# EAGLE design OpenSprinkler_v1.1 (EAGLE 5.11)
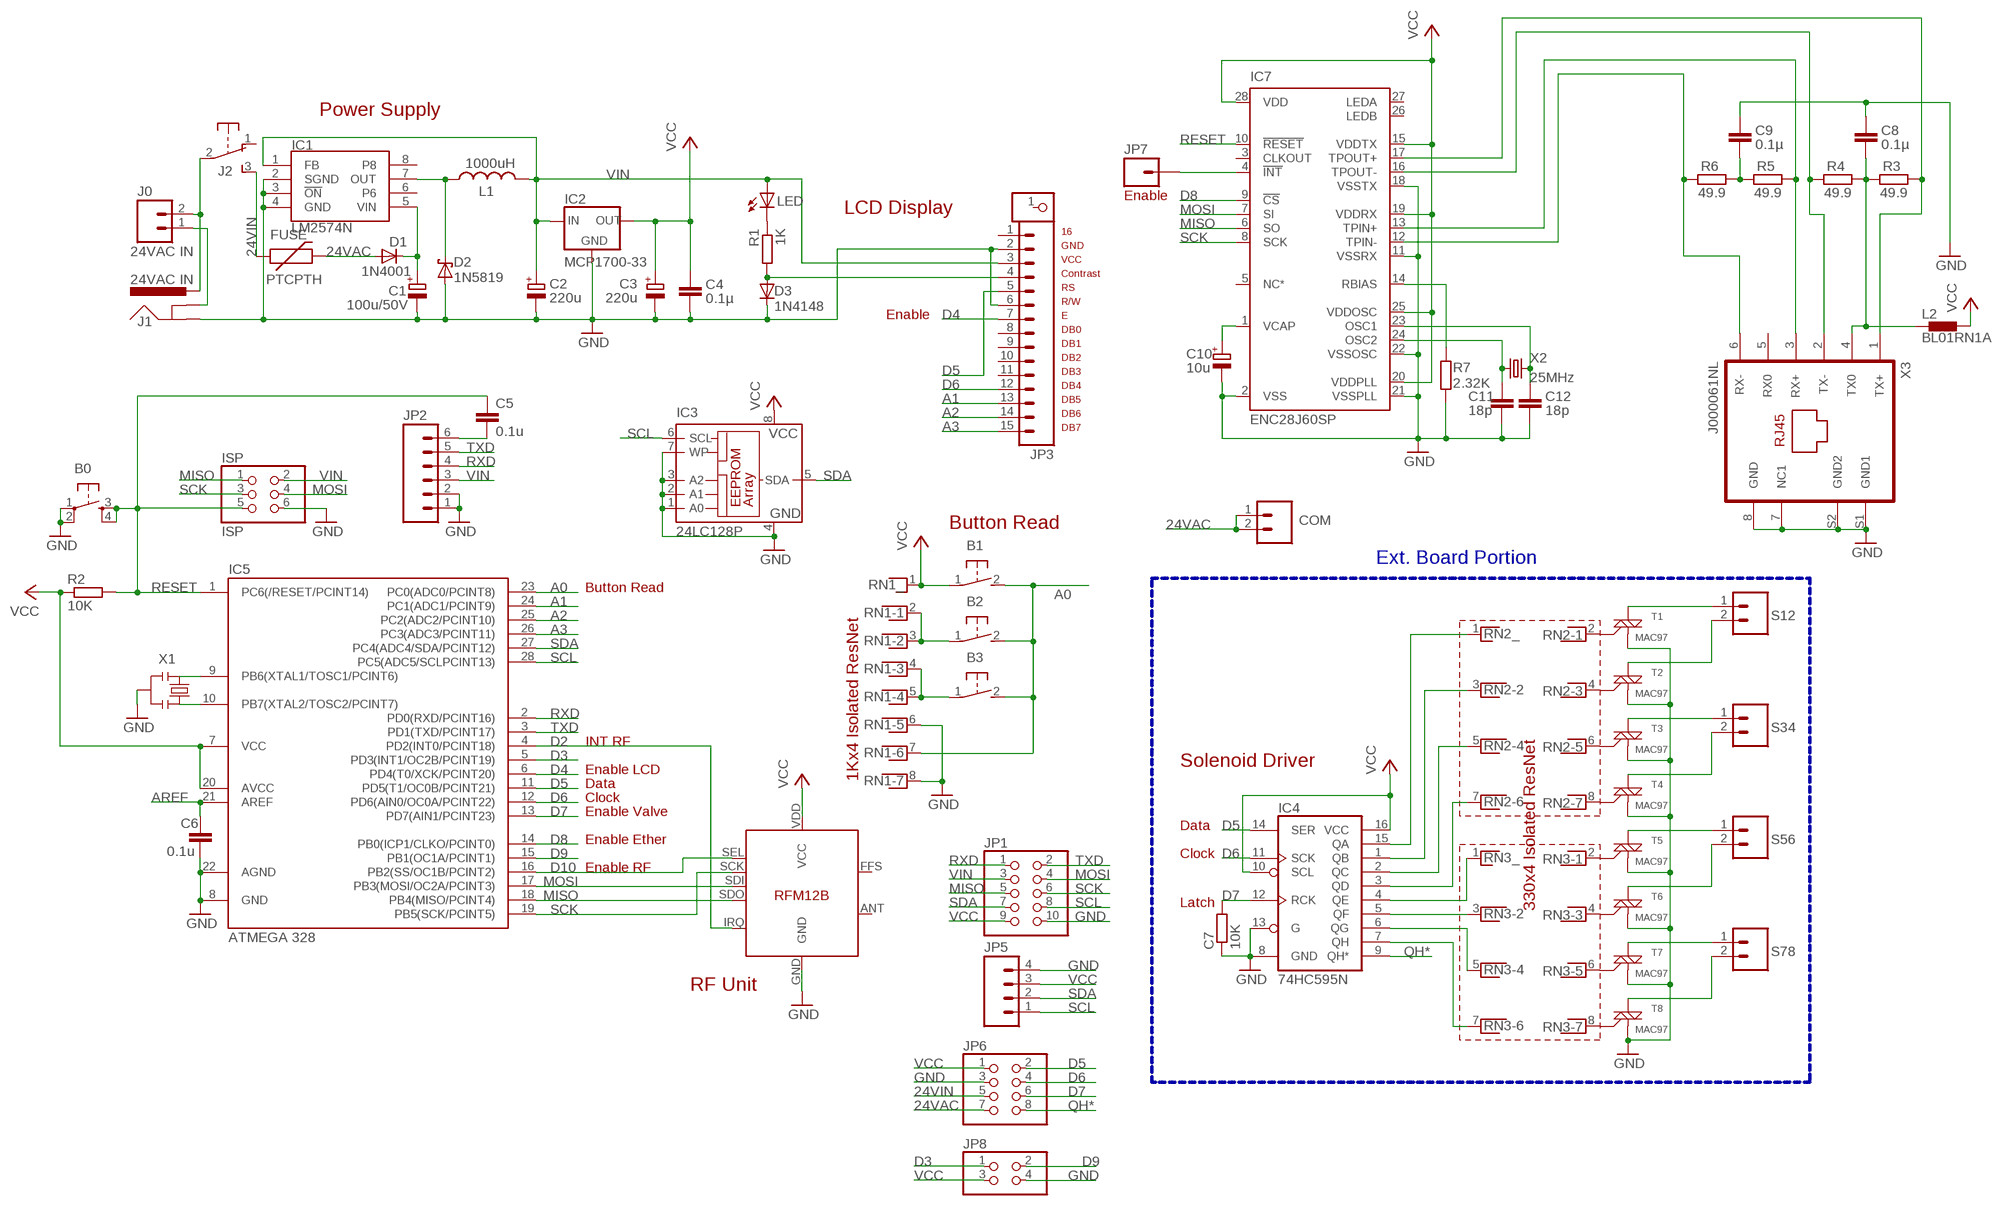
[diagram p0: schematic, sheet 1]

## Parts
B0  TAC_SWITCHPTH  [TACTILE-PTH]
B1  31-XX  [B3F-31XX]
B2  31-XX  [B3F-31XX]
B3  31-XX  [B3F-31XX]
C1  100u/50V  CPOL-EUE3.5-8  [E3,5-8]
C2  220u  CPOL-EUE2-5  [E2-5]
C3  220u  CPOL-EUE2-5  [E2-5]
C4  0.1µ  C-EU025-024X044  [C025-024X044]
C5  0.1u  C-EU025-024X044  [C025-024X044]
C6  0.1u  C-EU025-024X044  [C025-024X044]
C7  10K  R-EU_0204/7  [0204/7]
C8  0.1µ  C-EU025-024X044  [C025-024X044]
C9  0.1µ  C-EU025-024X044  [C025-024X044]
C10  10u  CPOL-EUE1.8-4  [E1,8-4]
C11  18p  C-EU025-024X044  [C025-024X044]
C12  18p  C-EU025-024X044  [C025-024X044]
COM  M025MM  [SCREWTERMINAL-5MM-2]
D1  1N4001  DIODE-DO41-7.6  [DO41-7.6]
D2  1N5819  1N5817-B  [DO41-7.6]
D3  1N4148  1N4148DO35-7  [DO35-7]
FUSE  PTCPTH  [PTC]
IC1  LM2574N  [DIL08]
IC2  MCP1700-33  MCP1700INLINE  [TO92-INLINE]
IC3  24LC128P  [DIL8]
IC4  74HC595N  74LS595N  [DIL16]
IC5  ATMEGA 328  ATMEGA48/88/168-PU  [DIL28-3]
IC6  RFM12B  [RFM12B]
IC7  ENC28J60SP  [DIL28-3]
ISP  ISP  PINHD-2X3  [2X03]
J0  24VAC IN  M025MM  [SCREWTERMINAL-5MM-2]
J1  24VAC IN  POWER_JACKPTH_LOCK  [POWER_JACK_PTH_LOCK]
J2  EG1206  [EG1206]
JP1  PINHD-2X5  [2X05]
JP2  M06SIP  [1X06]
JP3  M15  [1X15]
JP4  D  PINHD-1X1  [1X01]
JP5  M04LOCK  [1X04_LOCK]
JP6  PINHD-2X4  [2X04]
JP7  M01PTH  [1X01]
JP8  PINHD-2X2  [2X02]
L1  1000uH  L-US6000-XXX-RC  [6000-XXXX-RC]
L2  BL01RN1A  [BL01RN1A]
LED  POWERLED  LED3MM  [LED3MM]
R1  1K  R-EU_0204/7  [0204/7]
R2  10K  R-EU_0204/7  [0204/7]
R3  49.9  R-EU_0204/7  [0204/7]
R4  49.9  R-EU_0204/7  [0204/7]
R5  49.9  R-EU_0204/7  [0204/7]
R6  49.9  R-EU_0204/7  [0204/7]
R7  2.32K  R-EU_0204/7  [0204/7]
RN1  RNX7  [RN-8]
RN2  RNX7  [RN-8]
RN3  RNX7  [RN-8]
S12  M025MM  [SCREWTERMINAL-5MM-2]
S34  M025MM  [SCREWTERMINAL-5MM-2]
S56  M025MM  [SCREWTERMINAL-5MM-2]
S78  M025MM  [SCREWTERMINAL-5MM-2]
T1  MAC97  LX807DE  [TO-92]
T2  MAC97  LX807DE  [TO-92]
T3  MAC97  LX807DE  [TO-92]
T4  MAC97  LX807DE  [TO-92]
T5  MAC97  LX807DE  [TO-92]
T6  MAC97  LX807DE  [TO-92]
T7  MAC97  LX807DE  [TO-92]
T8  MAC97  LX807DE  [TO-92]
X1  RESONATORPTH  [RESONATOR-PTH]
X2  25MHz  CRYSTALHC49US  [HC49US]
X3  J000061NL  [PJ-J0-NOLED]

## Nets
24VAC [power]: COM.1 COM.2 D1.A FUSE.P$2 JP6.7
24VACIN [power]: J0.2 J1.PWR J2.2(P)
24VIN [power]: FUSE.P$1 J2.3(S) JP6.5
A0: B1.2(S) B2.2(S) B3.2(S) IC5.23(PC0(ADC0/PCINT8)) RN1.7
A1: IC5.24(PC1(ADC1/PCINT9)) JP3.13
A2: IC5.25(PC2(ADC2/PCINT10)) JP3.14
A3: IC5.26(PC3(ADC3/PCINT11)) JP3.15
AREF: C6.1 IC5.21(AREF)
D2: IC5.4(PD2(INT0/PCINT18)) IC6.IRQ
D3: IC5.5(PD3(INT1/OC2B/PCINT19)) JP8.1
D4: IC5.6(PD4(T0/XCK/PCINT20)) JP3.7
D5: IC4.14(SER) IC5.11(PD5(T1/OC0B/PCINT21)) JP3.5 JP6.2
D6: IC4.11(SCK) IC5.12(PD6(AIN0/OC0A/PCINT22)) JP3.12 JP6.4
D7: C7.2 IC4.12(RCK) IC5.13(PD7(AIN1/PCINT23)) JP6.6
D8: IC5.14(PB0(ICP1/CLKO/PCINT0)) IC7.9(!CS)
D9: IC5.15(PB1(OC1A/PCINT1)) JP8.2
D10: IC5.16(PB2(SS/OC1B/PCINT2)) IC6.SEL
GND [power]: B0.1 B0.2 C1.- C2.- C3.- C4.2 C6.2 C7.1 C8.1 C9.1 C10.- C11.2 C12.2 D2.A D3.C IC1.2(SGND) IC1.3(!ON) IC1.4(GND) IC2.1(GND) IC3.1(A0) IC3.2(A1) IC3.3(A2) IC3.4(GND) IC3.7(WP) IC4.8(GND) IC4.13(G) IC5.8(GND) IC5.22(AGND) IC6.GND IC7.2(VSS) IC7.11(VSSRX) IC7.18(VSSTX) IC7.21(VSSPLL) IC7.22(VSSOSC) ISP.6 J1.GND JP1.10 JP2.1 JP2.2 JP3.2 JP3.6 JP5.4 JP6.3 JP8.4 R7.2 RN1.6 RN1.8 T1.1(M1) T2.1(M1) T3.1(M1) T4.1(M1) T5.1(M1) T6.1(M1) T7.1(M1) T8.1(M1) X1.2 X3.7(NC1) X3.8(GND) X3.S1(GND1) X3.S2(GND2)
MISO: IC5.18(PB4(MISO/PCINT4)) IC6.SDO IC7.6(SO) ISP.1 JP1.5
MOSI: IC5.17(PB3(MOSI/OC2A/PCINT3)) IC6.SDI IC7.7(SI) ISP.4 JP1.4
N$2: IC5.9(PB6(XTAL1/TOSC1/PCINT6)) X1.1
N$3: RN2.2 T1.2(G)
N$4: IC4.5(QF) RN3.3
N$5: IC4.6(QG) RN3.5
N$6: C5.2 JP2.6
N$7: IC4.7(QH) RN3.7
N$8: IC5.10(PB7(XTAL2/TOSC2/PCINT7)) X1.3
N$9 [power]: C1.+ D1.C IC1.5(VIN)
N$10: IC4.4(QE) RN3.1
N$11: IC4.3(QD) RN2.7
N$12: IC4.2(QC) RN2.5
N$13: IC4.1(QB) RN2.3
N$14: IC4.15(QA) RN2.1
N$15: RN2.4 T2.2(G)
N$16: S12.1 T1.3(M2)
N$17: S12.2 T2.3(M2)
N$18: S34.1 T3.3(M2)
N$19: RN2.6 T3.2(G)
N$20: S34.2 T4.3(M2)
N$21: RN2.8 T4.2(G)
N$22: S56.1 T5.3(M2)
N$23: S56.2 T6.3(M2)
N$24: S78.1 T7.3(M2)
N$25: S78.2 T8.3(M2)
N$26: RN3.2 T5.2(G)
N$27: RN3.4 T6.2(G)
N$28: RN3.6 T7.2(G)
N$29: RN3.8 T8.2(G)
N$30: C8.2 L2.1 R3.1 R4.2 X3.4(TX0)
N$31: LED.K(C) R1.1
N$32: B2.1(P) RN1.2 RN1.3
N$33: IC7.4(!INT) JP7.1
N$35: B3.1(P) RN1.4 RN1.5
N$39: D3.A JP3.4 R1.2
N$40 [power]: D2.C IC1.7(OUT) L1.1
N$41: IC7.17(TPOUT+) R3.2 X3.1(TX+)
N$42: IC7.16(TPOUT-) R4.1 X3.2(TX-)
N$43: IC7.13(TPIN+) R5.2 X3.3(RX+)
N$44: IC7.12(TPIN-) R6.1 X3.6(RX-)
N$45 [power]: J0.1 J1.GNDBREAK
N$50: C10.+ IC7.1(VCAP)
N$51: IC7.14(RBIAS) R7.1
N$52: C11.1 IC7.24(OSC2) X2.1
N$53: C12.1 IC7.23(OSC1) X2.2
N$54: C9.2 R5.1 R6.2
QH*: IC4.9(QH*) JP6.8
RESET: B0.3 B0.4 C5.1 IC5.1(PC6(/RESET/PCINT14)) IC7.10(!RESET) ISP.5 R2.2
RXD: IC5.2(PD0(RXD/PCINT16)) JP1.1 JP2.4
SCK: IC5.19(PB5(SCK/PCINT5)) IC6.SCK IC7.8(SCK) ISP.3 JP1.6
SCL: IC3.6(SCL) IC5.28(PC5(ADC5/SCLPCINT13)) JP1.8 JP5.1
SDA: IC3.5(SDA) IC5.27(PC4(ADC4/SDA/PCINT12)) JP1.7 JP5.2
TXD: IC5.3(PD1(TXD/PCINT17)) JP1.2 JP2.5
VCC: B1.1(P) C3.+ C4.1 IC2.3(OUT) IC3.8(VCC) IC4.10(SCL) IC4.16(VCC) IC5.7(VCC) IC5.20(AVCC) IC6.VDD(VCC) IC7.15(VDDTX) IC7.19(VDDRX) IC7.20(VDDPLL) IC7.25(VDDOSC) IC7.28(VDD) JP1.9 JP5.3 JP6.1 JP8.3 L2.2 R2.1 RN1.1
VIN: C2.+ IC1.1(FB) IC2.2(IN) ISP.2 JP1.3 JP2.3 JP3.3 L1.2 LED.A
Unconnected: IC1.6 IC1.8 IC6.ANT IC6.FFS IC7.3(CLKOUT) IC7.5(NC*) IC7.26(LEDB) IC7.27(LEDA) J2.1(O) JP3.1 JP3.8 JP3.9 JP3.10 JP3.11 JP4.1 X3.5(RX0)

## Buses
B$1

## Notes on the sheet
- Power Supply
- Enable
- LCD Display
- 16
- GND
- VCC
- Contrast
- RS
- R/W
- Enable | E
- DB0
- DB1
- DB2
- DB3
- DB4
- DB5
- DB6
- DB7
- Button Read
- Ext. Board Portion
- Button Read
- 330x4 Isolated ResNet
- INT RF
- Solenoid Driver
- Enable LCD
- 1Kx4 Isolated ResNet
- Data
- Clock
- Enable Valve
- Data
- Enable Ether
- Clock
- Enable RF
- Latch
- RF Unit

## Library data of the parts
B0 = SparkFun:TAC_SWITCH: Momentary Switch Button commonly used for reset or general input. Spark Fun Electronics SKU : COM-00097
B1-B3 = adafruit:31-XX: OMRON SWITCH Now with beefier pads!
C1-C3 C10 = resistor:CPOL-EU: POLARIZED CAPACITOR, European symbol
C4 C8 C9 C11 C12 = resistor:C-EU: CAPACITOR, European symbol
C5 C6 = rcl:C-EU: CAPACITOR, European symbol
C7 R1-R7 = rcl:R-EU_: RESISTOR, European symbol
COM J0 S12 S34 S56 S78 = SparkFun:M02: Header 2 Standard 2-pin 0.1" header. Use with straight break away headers (SKU : PRT-00116), right angle break away headers (PRT-00553), swiss pins (PRT-00743), machine pins (PRT-00117), and female headers (PRT-00115). Molex polarized connector foot print use with SKU : PRT-08233 with associated crimp pins and housings.
D1 = diode:DIODE-: DIODE
D2 = diode:1N581*: 1.0A SCHOTTKY BARRIER RECTIFIER Source: http://www.diodes.com/datasheets/ds23001.pdf
D3 = diode:1N4148: DIODE high speed (Philips)
FUSE = SparkFunNew:PTC: Resettable Fuse PTC Resettable Fuse. Spark Fun Electronics SKU : COM-08357
IC1 = linear-technology:LM2574N
IC2 = adafruit:MCP1700: VOLTAGE REGULATOR
IC3 = microchip:24*: Serial EEPROM I2C; MF: MICROCHIP; MPN: 24LC128-I/P; OC_FARNELL: 9757929; OC_NEWARK: 12C2007
IC4 = SparkFun:74*595: 8-bit SHIFT REGISTER, output latch
IC5 = atmega8:ATMEGA48/88/168-PU
IC6 = JeeLabs:RFM12B
IC7 = microchip:ENC28J60: Stand-Alone Ethernet Controller with SPI Interface Source: http://ww1.microchip.com/downloads/en/DeviceDoc/39662c.pdf; MF: MICROCHIP; MPN: ENC28J60/SP; OC_FARNELL: 1084619; OC_NEWARK: 96K3661
ISP = pinhead:PINHD-2X3: PIN HEADER
J1 = SparkFun:POWER_JACK: Power Jack This is the standard 5.5mm barrel jack for power. The PTH is the most common, proven, reliable, footprint. All others are experimental. The Slot footprint only works if the mill layer is transmitted to the PCB fab house so be warned. Spark Fun Electronics SKU : PRT-00119. Mating wall wart : TOL-00298 (and others)
J2 = adafruit:EG1206
JP1 = pinhead:PINHD-2X5: PIN HEADER
JP2 = SparkFun:M06: Header 6 Standard 6-pin 0.1" header. Use with straight break away headers (SKU : PRT-00116), right angle break away headers (PRT-00553), swiss pins (PRT-00743), machine pins (PRT-00117), and female headers (PRT-00115). Molex polarized connector foot print use with SKU : PRT-08094 with associated crimp pins and housings. NOTES ON THE VARIANTS LOCK and LOCK_LONGPADS... This footprint was designed to help hold the alignment of a through-hole component (i.e. 6-pin header) while soldering it into place. You may notice that each hole has been shifted either up or down by 0.005 of an inch from it's more standard position (which is a perfectly straight line). This slight alteration caused the pins (the squares in the middle) to touch the edges of the holes. Because they are alternating, it causes a "brace" to hold the component in place. 0.005 has proven to be the perfect amount of "off-center" position when using our standard breakaway headers. Although looks a little odd when you look at the bare footprint, once you have a header in there, the alteration is very hard to notice. Also, if you push a header all the way into place, it is covered up entirely on the bottom side. This idea of altering the position of holes to aid alignment will be further integrated into the Sparkfun Library for other footprints. It can help hold any component with 3 or more connection pins.
JP3 = SparkFun:M15: Header 15 Standard 15-pin 0.1" header. Use with straight break away headers (SKU : PRT-00116), right angle break away headers (PRT-00553), swiss pins (PRT-00743), machine pins (PRT-00117), and female headers (PRT-00115).
JP4 = pinhead:PINHD-1X1: PIN HEADER
JP5 = SparkFunNew:M04: Header 4 Standard 4-pin 0.1" header. Use with straight break away headers (SKU : PRT-00116), right angle break away headers (PRT-00553), swiss pins (PRT-00743), machine pins (PRT-00117), and female headers (PRT-00115). Molex polarized connector foot print use with SKU : PRT-08231 with associated crimp pins and housings. 1MM SMD Version SKU: PRT-10208
JP6 = pinhead:PINHD-2X4: PIN HEADER
JP7 = SparkFun:M01: Header 1 Standard 1-pin 0.1" header. Use with straight break away headers (SKU : PRT-00116), right angle break away headers (PRT-00553), swiss pins (PRT-00743), machine pins (PRT-00117), and female headers (PRT-00115).
JP8 = pinhead:PINHD-2X2: PIN HEADER
L1 = rcl:L-US: INDUCTOR, American symbol
L2 = inductors:BL0: Noise Suppression Products/EMI Suppression Filters, Lead EMIFIL(R) Inductor Type Source: http://www.murata.com .. BL01RN1_DS.pdf
LED = adafruit:LED: LED OSRAM: - CHIPLED LG R971, LG N971, LY N971, LG Q971, LY Q971, LO R971, LY R971 LH N974, LH R974 LS Q976, LO Q976, LY Q976 LO Q996 - Hyper CHIPLED LW Q18S LB Q993, LB Q99A, LB R99A - SideLED LS A670, LO A670, LY A670, LG A670, LP A670 LB A673, LV A673, LT A673, LW A673 LH A674 LY A675 LS A676, LA A676, LO A676, LY A676, LW A676 LS A679, LY A679, LG A679 - Hyper Micro SIDELED® LS Y876, LA Y876, LO Y876, LY Y876 LT Y87S - SmartLED LW L88C, LW L88S LB L89C, LB L89S, LG L890 LS L89K, LO L89K, LY L89K LS L896, LA L896, LO L896, LY L896 - TOPLED LS T670, LO T670, LY T670, LG T670, LP T670 LSG T670, LSP T670, LSY T670, LOP T670, LYG T670 LG T671, LOG T671, LSG T671 LB T673, LV T673, LT T673, LW T673 LH T674 LS T676, LA T676, LO T676, LY T676, LB T676, LH T676, LSB T676, LW T676 LB T67C, LV T67C, LT T67C, LS T67K, LO T67K, LY T67K, LW E67C LS E67B, LA E67B, LO E67B, LY E67B, LB E67C, LV E67C, LT E67C LW T67C LS T679, LY T679, LG T679 LS T770, LO T770, LY T770, LG T770, LP T770 LB T773, LV T773, LT T773, LW T773 LH T774 LS E675, LA E675, LY E675, LS T675 LS T776, LA T776, LO T776, LY T776, LB T776 LHGB T686 LT T68C, LB T68C - Hyper Mini TOPLED® LB M676 - Mini TOPLED Santana® LG M470 LS M47K, LO M47K, LY M47K Source: http://www.osram.convergy.de/
RN1-RN3 = resistor-net:RNX7: RESISTOR NETWORK; OC_FARNELL: unknown; OC_NEWARK: unknown
T1-T8 = SparkFun:LX807DE: LX807DE Triac http://www.littelfuse.com/data/en/Data_Sheets/Littelfuse_Triac_LX8.pdf
X1 = SparkFun:RESONATOR: Resonator Small SMD resonator. This is the itty bitty 10/20MHz resonators with built in caps. CSTCE10M0G55 and CSTCE20M0V53. Footprint has been reviewed closely but hasn't been tested yet.
X2 = SparkFun:CRYSTAL: Crystals Various standard crystals. Proven footprints. Spark Fun Electronics SKU : COM-00534
X3 = con-pulse:J000061NL

## Net classes
0 default: width 0.406 mm, clearance 0.203 mm
1 power: width 0.813 mm, clearance 0.203 mm

## Board
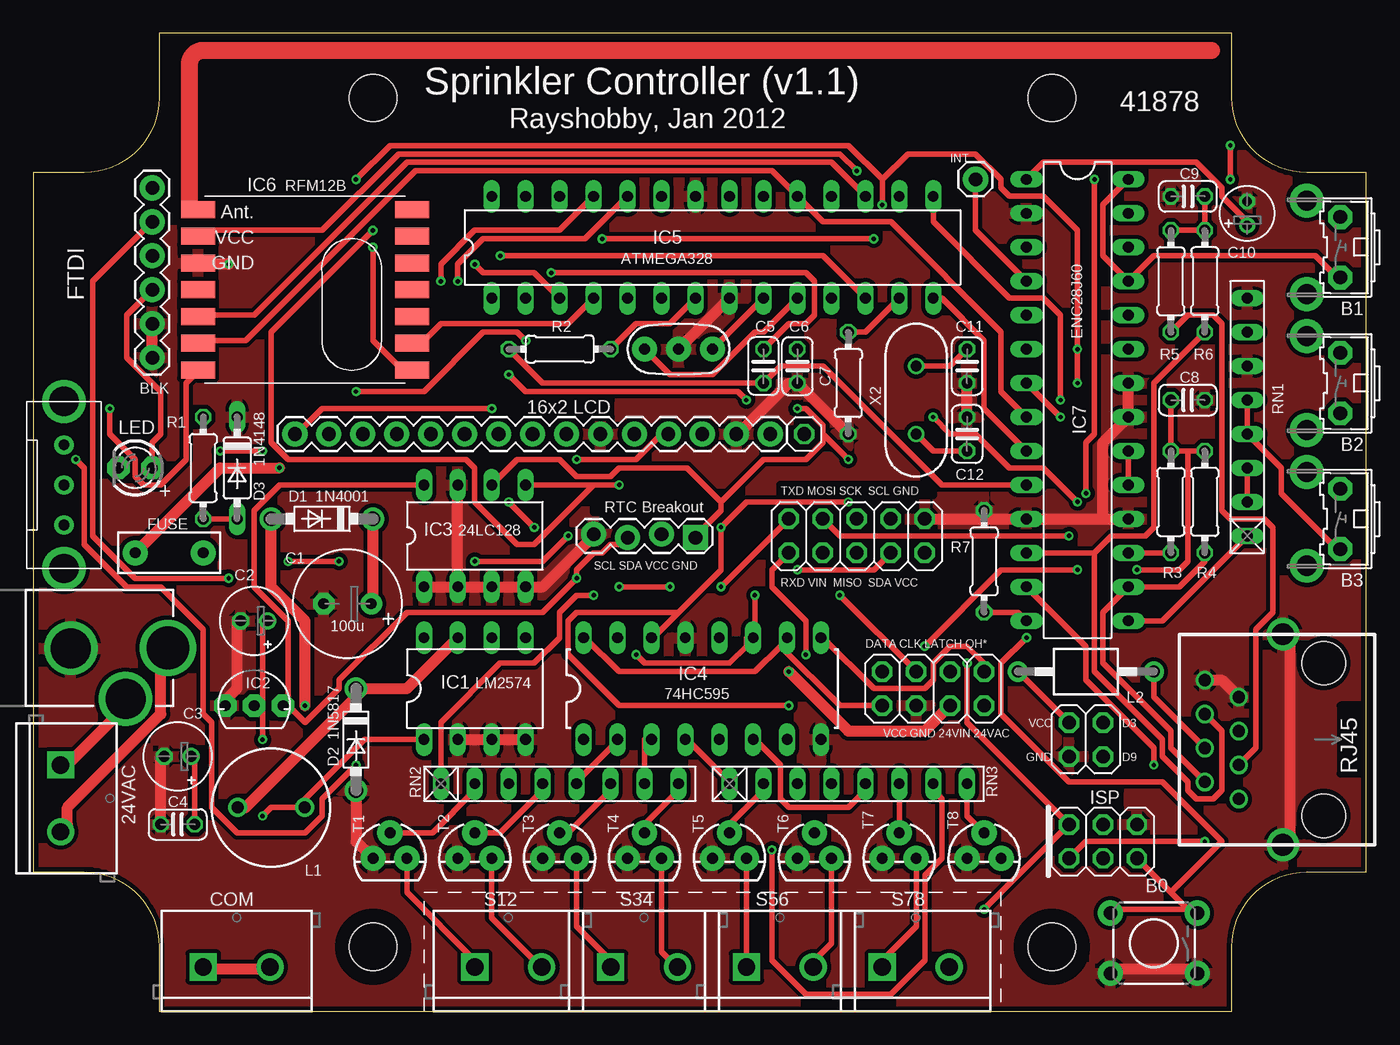
[diagram p1: board, top side]
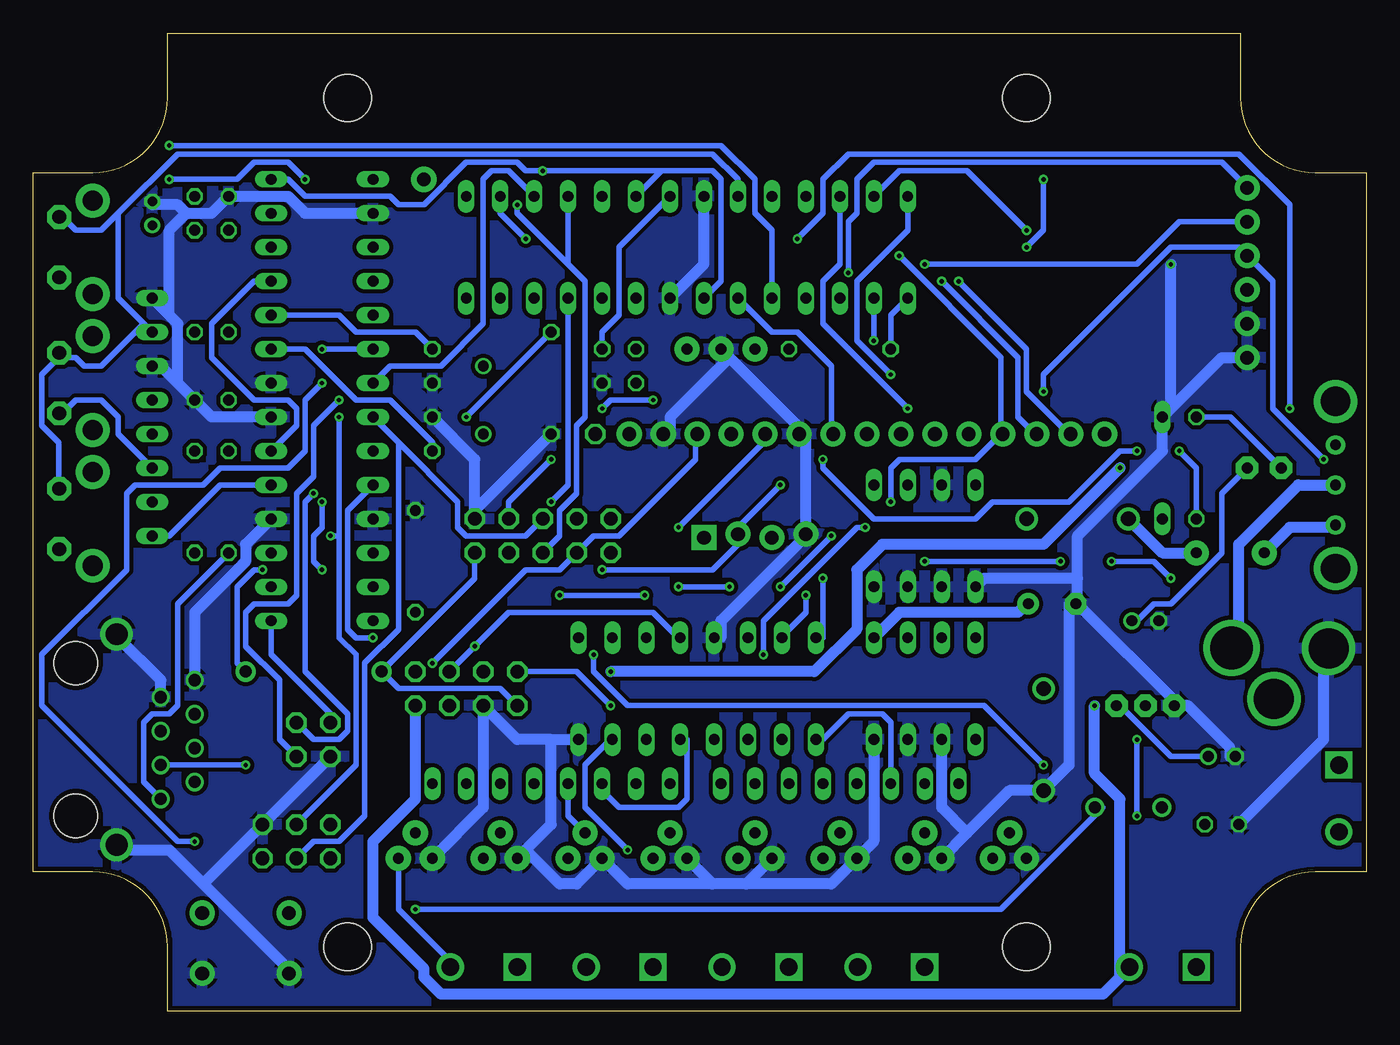
[diagram p2: board, bottom side, seen from below]

Size 99.69 x 73.15 mm. Coordinates in mm from the lower left corner, seen from the top.
Outline: 9.4,0 89.66,0 89.66,4.83 arc-90 95.25,10.41 99.69,10.41 99.69,62.74 95.25,62.74 arc-90 89.66,68.33 89.66,73.15 9.4,73.15 9.4,68.33 arc-90 3.81,62.74 0,62.74 0,10.41 3.81,10.41 arc-90 9.4,4.83 9.4,0
Copper layers (1*16): Top 0.0356mm / dielectric 1.5011mm / Bottom 0.0356mm
Design rules "LaenPCBOrder": minimum track width 6mil, minimum drill 13mil, track to track 6mil, track to pad 6mil, pad to pad 6mil, via to via 6mil, smd to smd 6mil, copper to edge 15mil, drill to drill 6mil, minimum pad ring 7mil, minimum via ring 7mil, stop-mask expansion 4mil, vias tented up to drill 0mil, thermal gap 10mil
Holes 3.56 mm at 25.4,4.83 76.2,4.83 25.4,68.33 76.2,68.33
tRestrict: area 22.9,2.3 to 27.9,7.4; area 73.7,2.3 to 78.7,7.4; area 9.7,65.3 to 89.4,72.6; area 6.3,43.2 to 8.9,44.5; area 78.7,15.2 to 81.3,16.5; area 97.8,17.8 to 99.1,22.9; area 35.6,44.5 to 43.2,45.7; area 55.9,38.6 to 67.3,39.4; area 55.9,31.8 to 67.3,32.5; area 41.9,37.3 to 50.8,38.1; area 41.9,33 to 50.8,33.8
bRestrict: area 9.7,65.3 to 89.4,72.6

### Footprints (pad centres in the part's own frame; a part is rotated, then mirrored left to right if it is on the bottom)
TACTILE-PTH = drill 1.016 pad 1.88 round: 1 -3.251,2.261; 2 3.251,2.261; 3 -3.251,-2.261; 4 3.251,-2.261
B3F-31XX = drill 1.016 pad 1.778 octagon: 1 -2.261,-1.245; 2 2.261,-1.245 | drill 1.499 pad 2.54 round: 3 -3.505,1.245; 4 3.505,1.245
E3,5-8 = drill 0.813 pad 1.6 round: + -1.778,0 | drill 0.813 pad 1.6 octagon: - 1.778,0
E2-5 = drill 0.813 pad 1.27 round: + -1.016,0 | drill 0.813 pad 1.27 octagon: - 1.016,0
C025-024X044 = drill 0.813 octagon: 1 -1.27,0; 2 1.27,0
0204/7 = drill 0.813 octagon: 1 -3.81,0; 2 3.81,0
E1,8-4 = drill 0.711 pad 1.168 round: + -0.889,0 | drill 0.711 pad 1.168 octagon: - 0.889,0
SCREWTERMINAL-5MM-2 = drill 1.3 pad 2.032 square: 1 0,0 | drill 1.3 pad 2.032 round: 2 5,0
DO41-7.6 = drill 1.1 pad 1.7 round: A 3.81,0; C -3.81,0
DO35-7 = drill 0.813 long: A 3.81,0; C -3.81,0
PTC = drill 0.8 pad 1.88 round: P$1 -2.54,0; P$2 2.54,0
DIL08 = drill 0.813 long: 1 -3.81,-3.81; 2 -1.27,-3.81; 3 1.27,-3.81; 4 3.81,-3.81; 5 3.81,3.81; 6 1.27,3.81; 7 -1.27,3.81; 8 -3.81,3.81
TO92-INLINE = drill 0.813 pad 1.676 octagon: 1 -2.159,0; 2 0,0; 3 2.159,0
DIL8 = drill 0.813 long: 1 -3.81,-3.81; 2 -1.27,-3.81; 3 1.27,-3.81; 4 3.81,-3.81; 5 3.81,3.81; 6 1.27,3.81; 7 -1.27,3.81; 8 -3.81,3.81
DIL16 = drill 0.813 long: 1 -8.89,-3.81; 2 -6.35,-3.81; 3 -3.81,-3.81; 4 -1.27,-3.81; 5 1.27,-3.81; 6 3.81,-3.81; 7 6.35,-3.81; 8 8.89,-3.81; 9 8.89,3.81; 10 6.35,3.81; 11 3.81,3.81; 12 1.27,3.81; 13 -1.27,3.81; 14 -3.81,3.81; 15 -6.35,3.81; 16 -8.89,3.81
DIL28-3 = drill 0.813 long: 1 -16.51,-3.81; 2 -13.97,-3.81; 3 -11.43,-3.81; 4 -8.89,-3.81; 5 -6.35,-3.81; 6 -3.81,-3.81; 7 -1.27,-3.81; 8 1.27,-3.81; 9 3.81,-3.81; 10 6.35,-3.81; 11 8.89,-3.81; 12 11.43,-3.81; 13 13.97,-3.81; 14 16.51,-3.81; 15 16.51,3.81; 16 13.97,3.81; 17 11.43,3.81; 18 8.89,3.81; 19 6.35,3.81; 20 3.81,3.81; 21 1.27,3.81; 22 -1.27,3.81; 23 -3.81,3.81; 24 -6.35,3.81; 25 -8.89,3.81; 26 -11.43,3.81; 27 -13.97,3.81; 28 -16.51,3.81
RFM12B = smd 2.54 x 1.27: ANT 8,-6; FFS -8,2; GND 8,-2; IRQ -8,4; P$8 -8,0; P$9 -8,-2; P$10 -8,-4; P$12 -8,-6; P$16 8,0; SCK 8,4; SDI 8,2; SDO -8,6; SEL 8,6; VDD 8,-4
2X03 = drill 1.016 octagon: 1 -2.54,-1.27; 2 -2.54,1.27; 3 0,-1.27; 4 0,1.27; 5 2.54,-1.27; 6 2.54,1.27
POWER_JACK_PTH_LOCK = drill 2.997 round: GND 0.025,6.608; GNDBREAK 3.812,10.7 | drill 3.2 round: PWR 0,13.878
EG1206 = drill 0.8 pad 1.422 round: 1 -3,0; 2 0,0; 3 3,0 | drill 2.2 round: MT1 -6.25,0; MT2 6.25,0
2X05 = drill 1.016 octagon: 1 -5.08,-1.27; 2 -5.08,1.27; 3 -2.54,-1.27; 4 -2.54,1.27; 5 0,-1.27; 6 0,1.27; 7 2.54,-1.27; 8 2.54,1.27; 9 5.08,-1.27; 10 5.08,1.27
1X06 = drill 1.016 pad 1.88 round: 1 0,0; 2 2.54,0; 3 5.08,0; 4 7.62,0; 5 10.16,0; 6 12.7,0
1X15 = drill 1.016 pad 1.88 round: 1 0,0; 2 2.54,0; 3 5.08,0; 4 7.62,0; 5 10.16,0; 6 12.7,0; 7 15.24,0; 8 17.78,0; 9 20.32,0; 10 22.86,0; 11 25.4,0; 12 27.94,0; 13 30.48,0; 14 33.02,0; 15 35.56,0
1X01 = drill 1.016 octagon: 1 0,0
1X04_LOCK = drill 1.016 pad 1.88 square: 1 0,0.127 | drill 1.016 pad 1.88 round: 2 2.54,-0.127; 3 5.08,0.127; 4 7.62,-0.127
2X04 = drill 1.016 octagon: 1 -3.81,-1.27; 2 -3.81,1.27; 3 -1.27,-1.27; 4 -1.27,1.27; 5 1.27,-1.27; 6 1.27,1.27; 7 3.81,-1.27; 8 3.81,1.27
1X01' = drill 1.016 pad 1.88 round: 1 0,0
2X02 = drill 1.016 octagon: 1 -1.27,-1.27; 2 -1.27,1.27; 3 1.27,-1.27; 4 1.27,1.27
6000-XXXX-RC = drill 0.9 pad 1.422 round: 1 -2.5,0; 2 2.5,0
BL01RN1A = drill 0.9 pad 1.5 round: 1 -5.08,0; 2 5.08,0
LED3MM = drill 0.813 pad 1.676 octagon: A -1.27,0; K 1.27,0
RN-8 = drill 0.813 long: 1 -8.89,0; 2 -6.35,0; 3 -3.81,0; 4 -1.27,0; 5 1.27,0; 6 3.81,0; 7 6.35,0; 8 8.89,0
TO-92 = drill 0.813 pad 1.88 round: 1 -1.27,0; 2 0,1.905; 3 1.27,0
RESONATOR-PTH = drill 0.8 pad 1.88 round: 1 -2.54,0; 2 0,0; 3 2.54,0
HC49US = drill 0.813 round: 1 -2.54,0; 2 2.54,0
PJ-J0-NOLED = drill 0.914 round: 1 4.445,-6.35; 2 3.175,-8.89; 3 1.905,-6.35; 4 0.635,-8.89; 5 -0.635,-6.35; 6 -1.905,-8.89; 7 -3.175,-6.35; 8 -4.445,-8.89 | drill 1.626 round: S1 -7.874,-3.048; S2 7.874,-3.048 | hole 3.251: -5.715,0; 5.715,0

### Placement (x,y rotation side)
B0  83.82,5.08 180 top
B1  96.52,57.15 90 top
B2  96.52,46.99 90 top
B3  96.52,36.83 90 top
C1  23.5,30.48 180 top
C2  16.51,29.21 180 top
C3  10.79,19.05 180 top
C4  10.79,13.97 180 top
C5  54.61,48.26 90 top
C6  57.15,48.26 270 top
C7  60.96,46.99 90 top
C8  86.36,45.72 180 top
C9  86.36,60.96 0 top
C10  90.81,59.69 90 top
C11  69.85,48.26 270 top
C12  69.85,43.18 90 top
COM  12.7,3.3 0 top
D1  21.59,36.83 180 top
D2  24.13,20.32 270 top
D3  15.24,40.64 270 top
FUSE  10.16,34.29 0 top
IC1  33.02,24.13 0 top
IC2  16.51,22.86 0 top
IC3  33.02,35.56 0 top
IC4  50.04,24.13 0 top
IC5  50.8,57.15 0 top
IC6  20.32,53.98 180 top
IC7  78.11,45.72 270 top
ISP  80.01,12.7 0 top
J0  2.03,18.41 270 top
J1  -3.81,27.18 270 top
J2  2.29,39.37 270 top
JP1  61.59,35.56 0 top
JP2  8.89,48.9 90 top
JP3  55.12,43.18 180 top
JP4  57.66,43.18 0 top
JP5  49.53,35.56 180 top
JP6  67.31,24.13 0 top
JP7  M01PTH  [1X01']  70.48,62.23 0 top
JP8  78.74,20.32 180 top
L1  17.78,15.24 0 top
L2  78.74,25.4 180 top
LED  7.62,40.64 180 top
R1  12.7,40.64 270 top
R2  39.37,49.53 180 top
R3  85.09,38.1 270 top
R4  87.63,38.1 90 top
R5  85.09,54.61 270 top
R6  87.63,54.61 90 top
R7  71.12,33.66 90 top
RN1  90.81,44.45 90 top
RN2  39.37,17.02 0 top
RN3  60.96,17.02 0 top
S12  33.02,3.3 0 top
S34  43.18,3.3 0 top
S56  53.34,3.3 0 top
S78  63.5,3.3 0 top
T1  26.67,11.43 0 top
T2  33.02,11.43 0 top
T3  39.37,11.43 0 top
T4  45.72,11.43 0 top
T5  52.07,11.43 0 top
T6  58.42,11.43 0 top
T7  64.77,11.43 0 top
T8  71.12,11.43 0 top
X1  48.26,49.53 180 top
X2  66.04,45.72 270 top
X3  96.52,20.32 270 top

### Tracks (layer width: path | path; a pad name or v marks a point on that pad's centre or on a via)
24VAC  (via drill 0.33)
  Top 0.813: COM.1 12.7,3.17 17.14,3.17 COM.2 | D1.A 17.78,31.75 20.32,29.21 v20.32,22.86
  Bottom 0.813: D1.A 15.24,34.29 FUSE.P$2 | JP6.7 71.12,15.88 74.3,12.7 74.3,6.99 70.48,3.17 70.48,2.54 69.22,1.27 19.68,1.27 18.41,2.54 | 18.41,2.54 17.78,3.17 COM.2 | v20.32,22.86 20.32,17.78 18.41,15.88 18.41,2.54
24VACIN
  Top 0.813: J0.2 2.54,13.97 2.54,15.24 9.53,22.23 9.53,26.67 J1.PWR
  Bottom 0.813: J2.2 5.08,39.37 9.53,34.92 9.53,27.3 J1.PWR
24VIN  (via drill 0.33)
  Top 0.813: JP6.5 66.67,20.95 60.96,20.95 v56.52,25.4 | v18.41,40.64 13.97,40.64 FUSE.P$1
  Bottom 0.813: FUSE.P$1 5.71,36.2 2.54,36.2 J2.3 | v56.52,25.4 41.27,25.4 38.1,28.57 38.1,33.02 36.2,34.92 24.13,34.92 v18.41,40.64
A0
  Bottom 0.406: B3.2 97.79,39.37 97.79,42.55 99.06,43.81 99.06,47.62 97.79,48.9 B2.2 97.16,48.9 96.52,48.9 95.89,48.26 94.61,48.26 91.44,51.44 | IC5.23 46.99,62.23 48.9,64.14 88.9,64.14 93.34,59.69 | 93.34,59.69 94.61,58.42 96.52,58.42 97.16,59.05 B1.2 | 91.44,51.44 93.34,53.34 93.34,59.69 | 91.44,51.44 RN1.7
A1  (via drill 0.33)
  Top 0.406: IC5.24 41.27,57.78 33.66,57.78 31.75,55.88 v31.75,54.61
  Bottom 0.406: v31.75,54.61 26.04,48.9 26.04,44.45 24.77,43.18 JP3.13
A2  (via drill 0.33)
  Top 0.406: IC5.25 39.37,58.42 33.02,58.42 30.48,55.88 v30.48,54.61
  Bottom 0.406: v30.48,54.61 25.4,49.53 25.4,46.35 22.23,43.18 JP3.14
A3  (via drill 0.33)
  Top 0.406: v34.29,45.09 21.59,45.09 19.68,43.18 JP3.15
  Bottom 0.406: IC5.26 39.37,55.88 40.64,54.61 40.64,51.44 v34.29,45.09
AREF
  Bottom 0.406: C6.1 57.15,50.8 55.88,52.07 55.88,57.15 IC5.21
D2
  Top 0.406: IC5.4 40.01,51.44 30.48,51.44 28.57,49.53 IC6.IRQ
D3  (via drill 0.33)
  Top 0.406: v89.53,64.77 v89.53,62.23 | v79.38,62.23 79.38,43.18 78.74,42.55 v78.74,38.73
  Bottom 0.406: IC5.5 44.45,58.42 45.72,59.69 45.72,62.23 48.26,64.77 v89.53,64.77 | v89.53,62.23 84.45,62.23 83.19,63.5 80.64,63.5 v79.38,62.23 | v78.74,38.73 79.38,38.1 79.38,25.4 76.2,22.23 76.2,20.95 76.83,20.32 78.74,20.32 JP8.1
D4
  Bottom 0.406: IC5.6 44.45,50.8 42.55,50.8 40.01,48.26 40.01,43.18 JP3.7
D5  (via drill 0.33)
  Top 0.406: 48.26,29.84 51.44,33.02 v51.44,36.2 53.34,38.1 v60.96,38.1 | 48.26,29.84 46.35,27.94 IC4.14 | v56.52,22.86 43.81,22.86 40.01,26.67 40.01,29.21 40.64,29.84 48.26,29.84
  Bottom 0.406: v51.44,36.2 44.45,43.18 JP3.5 | IC5.11 59.69,39.37 v60.96,38.1 | JP6.2 59.05,25.4 v56.52,22.86
D6  (via drill 0.33)
  Top 0.406: v53.98,31.11 53.98,27.94 IC4.11 53.34,27.94 53.34,27.3 52.07,26.04 45.72,26.04 v45.09,26.67 | v60.33,31.11 JP6.4 | IC5.12 59.05,56.52 v34.92,56.52 | v35.56,38.1 v37.47,36.2
  Bottom 0.406: v53.98,31.11 v60.33,31.11 | v34.92,56.52 27.3,48.9 27.3,43.18 | v45.09,26.67 45.09,29.21 38.1,36.2 v37.47,36.2 | v35.56,38.1 35.56,40.64 34.92,41.27 29.21,41.27 27.3,43.18 | JP3.12 27.3,43.18
D7  (via drill 0.33)
  Top 0.406: C7.2 62.23,50.8 IC5.13 | v67.31,44.45 68.58,43.18 70.48,43.18 73.03,40.64 75.56,40.64 v78.11,38.1 | v78.11,33.02 72.39,33.02 v66.67,27.3
  Bottom 0.406: JP6.6 v66.67,27.3 64.14,29.84 53.34,29.84 51.44,27.94 IC4.12 | v67.31,44.45 C7.2 | v78.11,38.1 78.11,36.2 78.74,35.56 78.74,33.66 v78.11,33.02
D8
  Top 0.406: IC7.9 71.12,45.09 71.12,50.16 67.94,53.34 IC5.14
D9  (via drill 0.33)
  Top 0.406: IC5.15 67.31,59.05 73.03,53.34 75.56,53.34 76.83,52.07 v76.83,45.72
  Bottom 0.406: v76.83,45.72 78.74,43.81 78.74,40.01 80.01,38.73 80.01,31.11 80.64,30.48 83.19,30.48 83.82,29.84 83.82,27.3 81.28,24.77 81.28,20.32 JP8.2
D10  (via drill 0.33)
  Top 0.406: v42.55,57.78 v62.87,57.78 | v5.71,45.09 5.71,43.18 7.62,41.27 7.62,40.01 8.26,39.37 9.53,39.37 11.43,41.27 11.43,46.99 12.06,47.62 IC6.SEL
  Bottom 0.406: IC5.16 64.77,59.69 v62.87,57.78 | v42.55,57.78 40.64,59.69 40.64,62.23 38.73,64.14 9.53,64.14 5.71,60.33 v5.71,45.09
GND  (via drill 0.33)
  Top 0.813: D2.A 24.13,12.7 T1.1 | IC1.2 IC1.3 IC1.4 | v14.61,55.88 12.7,55.88 IC6.GND | JP2.1 JP2.2 | C4.2 9.53,19.05 C3.- | C2.- 15.24,29.21 15.24,24.13 13.97,22.86 IC2.1 | X1.2 IC5.8 | IC3.1 IC3.2 | IC3.2 IC3.3 IC3.4 38.1,31.75 41.91,35.56 JP5.4 | IC3.2 IC3.7 | B0.2 80.64,3.17 87,3.17 B0.1 | X3.8 88.9,24.77 X3.7 | X3.S2 93.98,12.7 93.98,27.94 X3.S1 | IC7.22 IC7.21 80.01,42.55 80.01,36.83 | C7.1 C6.2 56.52,46.99 52.7,43.18 JP3.2 | C12.2 C11.2 | JP1.10 71.12,36.83 | 71.12,36.83 IC7.11 80.01,36.83 | 71.12,36.83 R7.2 | 80.01,36.83 IC7.18
  Bottom 0.813: 29.84,13.34 26.67,16.51 D2.A 22.23,18.41 22.23,30.48 C1.- 21.59,30.48 | 29.84,13.34 T2.1 | IC1.4 36.83,12.7 T3.1 40.01,9.53 46.35,9.53 | 29.84,13.34 31.75,15.24 IC1.2 | 46.35,9.53 T4.1 | 46.35,9.53 48.9,9.53 | 48.9,9.53 T5.1 | 48.9,9.53 55.24,9.53 T6.1 59.05,9.53 60.33,9.53 62.87,12.06 | 60.96,20.32 63.5,20.32 JP6.3 66.04,15.24 T8.1 | 60.96,20.32 IC4.8 | 62.87,12.06 60.96,13.97 60.96,20.32 | 62.87,12.06 T7.1 | 14.61,45.09 10.79,48.9 JP2.1 | 14.61,45.09 D3.C 15.24,41.91 21.59,35.56 21.59,32.38 | 14.61,45.09 v14.61,55.88 | 13.97,22.86 21.59,30.48 | 13.97,22.86 13.34,22.86 10.16,19.68 10.16,19.05 C3.- | 13.97,22.86 IC2.1 | C4.2 3.17,20.32 3.17,26.67 J1.GND | 21.59,30.48 21.59,32.38 | IC5.22 49.53,55.88 IC5.8 | IC4.13 48.26,27.94 48.26,29.21 41.91,35.56 JP5.4 41.91,43.18 | 41.91,43.18 47.62,48.9 | 41.91,43.18 JP3.6 | JP8.4 ISP.6 87,9.53 | X3.7 90.17,24.77 93.34,27.94 X3.S1 | 87,9.53 89.53,12.06 93.34,12.06 X3.S2 | 87,9.53 80.64,3.17 B0.2 | 88.27,59.69 88.9,60.33 90.81,60.33 C10.- | 88.27,59.69 86.36,59.69 C9.1 80.64,60.96 79.38,59.69 IC7.2 | 88.9,46.99 90.17,48.26 RN1.6 | 88.9,46.99 C8.1 86.36,44.45 IC7.21 | 89.53,52.07 88.9,51.44 88.9,46.99 | 89.53,52.07 RN1.8 | 88.27,59.69 89.53,58.42 89.53,52.07 | C12.2 66.67,41.27 66.67,37.47 | C7.1 66.67,37.47 | 66.67,37.47 JP1.10 | X3.8 87.63,29.84 83.82,33.66 83.82,34.92 IC7.18 | 47.62,48.9 52.07,44.45 52.07,43.18 JP3.2 | 47.62,48.9 X1.2 | 21.59,32.38 28.57,32.38 IC3.1
  pour Top (isolate 0.305): 0,73.66 100.33,73.66 100.33,0 0,0
  pour Bottom (isolate 0.305): 0,73.66 100.33,73.66 100.33,0 0,0
MISO  (via drill 0.33)
  Top 0.406: 63.5,62.23 65.41,64.14 70.48,64.14 72.39,62.23 72.39,61.59 73.03,60.96 75.56,60.96 78.11,58.42 v78.11,49.53 v78.11,46.99 | 63.5,62.23 v63.5,60.33 | v25.4,57.15 25.4,50.16 27.3,48.26 27.94,48.26 IC6.SDO | v24.13,62.23 26.67,64.77 60.96,64.77 63.5,62.23 | ISP.1 78.74,12.7 v87.63,12.7
  Bottom 0.406: 59.69,55.88 IC5.18 | 59.69,55.88 58.42,54.61 58.42,44.45 59.05,43.81 59.05,38.73 60.33,37.47 60.33,35.56 JP1.5 | v78.11,49.53 IC7.6 | v63.5,60.33 63.5,59.69 59.69,55.88 | v25.4,57.15 24.13,58.42 v24.13,62.23 | v87.63,12.7 88.9,12.7 99.06,22.86 99.06,26.67 92.71,33.02 92.71,38.73 92.08,39.37 87,39.37 85.72,40.64 80.64,40.64 79.38,41.91 79.38,45.72 v78.11,46.99
MOSI  (via drill 0.33)
  Top 0.406: IC5.17 59.69,63.5 27.94,63.5 16.51,52.07 12.7,52.07 IC6.SDI | IC7.7 v76.83,44.45 | JP1.4 60.33,35.56 v77.47,35.56
  Bottom 0.406: IC5.17 64.14,62.87 65.41,62.87 66.04,62.23 66.04,51.44 69.22,48.26 73.03,48.26 IC7.7 | ISP.4 75.56,18.41 75.56,26.67 76.83,27.94 76.83,35.56 | v76.83,44.45 76.83,35.56 | 76.83,35.56 v77.47,35.56
N$1
  Top 1.27: 11.68,60.2 11.68,70.87 arc-90 12.7,71.88 88.14,71.88
N$2
  Top 0.406: X1.1 IC5.9
N$3
  Top 0.406: T1.2 29.84,13.34 33.02,16.51 RN2.2
N$4
  Bottom 0.406: RN3.3 57.15,16.51 55.88,15.24 51.44,15.24 50.8,15.88 50.8,20.32 IC4.5
N$5
  Top 0.406: IC4.6 53.98,20.32 55.88,18.41 55.88,15.88 56.52,15.24 60.96,15.24 62.23,16.51 RN3.5
N$6  (via drill 0.33)
  Top 0.406: C5.2 56.52,51.44 57.78,51.44 58.42,52.07 58.42,54.61 57.78,55.24 v38.73,55.24
  Bottom 0.406: v38.73,55.24 38.73,59.05 38.1,59.69 38.1,62.23 36.83,63.5 10.79,63.5 JP2.6
N$7  (via drill 0.33)
  Top 0.406: v55.24,12.06 55.24,3.81 57.78,1.27 64.14,1.27 66.67,3.81 66.67,10.16 67.94,11.43 67.94,15.88 67.31,16.51 RN3.7
  Bottom 0.406: v55.24,12.06 58.42,15.24 58.42,18.41 56.52,20.32 IC4.7
N$8
  Top 0.406: IC5.10 54.61,50.8 53.98,50.8 50.8,47.62 47.62,47.62 X1.3
N$9
  Top 0.813: D1.C 25.4,30.48 C1.+
  Bottom 0.813: IC1.5 34.92,29.84 26.04,29.84 25.4,30.48 C1.+
N$10
  Top 0.406: RN3.1 52.07,17.14 48.9,20.32 IC4.4
N$11
  Top 0.406: RN2.7 45.72,20.32 IC4.3
N$12
  Top 0.406: RN2.5 40.64,17.14 43.81,20.32 IC4.2
N$13
  Bottom 0.406: RN2.3 35.56,21.59 36.2,22.23 38.73,22.23 40.64,20.32 IC4.1
N$14  (via drill 0.33)
  Top 0.406: v41.91,31.11 40.64,31.11 39.37,29.84 39.37,27.94 37.47,26.04 34.92,26.04 30.48,21.59 RN2.1
  Bottom 0.406: v41.91,31.11 41.91,29.84 43.81,27.94 IC4.15
N$15
  Top 0.406: T2.2 34.92,13.34 38.1,16.51 RN2.4
N$16
  Top 0.406: T1.3 27.94,8.89 33.02,3.81 S12.1
N$17
  Top 0.406: T2.3 34.29,6.99 37.47,3.81 S12.2
N$18
  Top 0.406: T3.3 40.64,6.35 43.18,3.81 S34.1
N$19
  Top 0.406: T3.2 40.01,13.34 43.18,16.51 RN2.6
N$20
  Top 0.406: T4.3 46.99,4.45 47.62,3.81 S34.2
N$21
  Top 0.406: T4.2 45.72,13.97 48.26,16.51 RN2.8
N$22
  Top 0.406: S56.1 T5.3
N$23
  Top 0.406: T6.3 59.69,5.08 58.42,3.81 S56.2
N$24
  Top 0.406: T7.3 66.04,6.35 63.5,3.81 S78.1
N$25
  Bottom 0.406: T8.3 72.39,7.62 68.58,3.81 S78.2
N$26
  Top 0.406: T5.2 52.07,13.97 54.61,16.51 RN3.2
N$27
  Bottom 0.406: T6.2 59.69,14.61 RN3.4
N$28
  Top 0.406: T7.2 RN3.6
N$29
  Top 0.406: T8.2 69.85,14.61 RN3.8
N$30  (via drill 0.33)
  Top 0.406: 86.36,41.91 R4.2 | 86.36,41.91 R3.1 C8.2 | X3.4 83.82,23.5 L2.1 | 86.36,41.91 86.36,33.66 85.72,33.02 v82.55,33.02
  Bottom 0.406: v82.55,33.02 83.19,33.02 84.45,31.75 84.45,26.04 L2.1
N$31
  Bottom 0.406: R1.1 10.16,44.45 LED.K
N$32
  Top 0.406: RN1.2 RN1.3
  Bottom 0.406: RN1.3 93.34,43.18 93.34,44.45 94.61,45.72 96.52,45.72 97.16,45.09 B2.1
N$33
  Top 0.406: IC7.4 70.48,58.42 JP7.1
N$35
  Top 0.406: RN1.5 RN1.4 93.34,40.64 93.34,38.73 97.16,34.92 B3.1
N$39  (via drill 0.33)
  Top 0.406: R1.2 D3.A | v13.97,41.91 v17.14,41.91 | v40.64,41.27 45.09,41.27 46.99,43.18 JP3.4
  Bottom 0.406: R1.2 12.7,40.64 v13.97,41.91 | v17.14,41.91 18.41,41.91 22.23,38.1 27.94,38.1 29.21,36.83 36.83,36.83 40.64,40.64 v40.64,41.27
N$40
  Top 0.813: IC1.7 27.94,24.13 24.77,24.13 | 24.77,24.13 15.88,15.24 L1.1 | 24.77,24.13 D2.C
N$41
  Top 0.406: R3.2 IC7.17
  Bottom 0.406: X3.1 91.44,17.14 91.44,21.59 90.81,22.23 89.53,22.23 88.9,22.86 88.9,30.48 R3.2
N$42
  Top 0.406: R4.1 87.63,33.66 85.72,31.75 IC7.16 80.01,29.84 80.01,26.04 85.09,20.95 85.09,19.68 X3.2
N$43  (via drill 0.33)
  Top 0.406: IC7.13 78.74,27.3 78.74,24.77 83.82,19.68 v83.82,18.41 | R5.2 86.36,52.07 88.27,52.07 88.9,51.44 88.9,37.47 89.53,36.83 92.08,36.83 92.71,36.2 92.71,29.84 91.44,28.57 91.44,19.68 X3.3
  Bottom 0.406: v83.82,18.41 X3.3
N$44
  Top 0.406: 79.38,34.29 IC7.12 | 79.38,34.29 80.64,35.56 83.19,35.56 83.82,36.2 83.82,46.99 R6.1 | X3.6 88.9,20.95 88.9,16.51 88.27,15.88 87,15.88 86.36,16.51 86.36,17.14 84.45,19.05 84.45,20.32 79.38,25.4 79.38,34.29
N$45
  Top 0.813: J0.1 2.54,18.41 6.99,22.86 J1.GNDBREAK
N$50
  Top 0.406: IC7.1 75.56,63.5 87,63.5 88.9,61.59 88.9,60.96 90.81,59.05 C10.+
N$51
  Top 0.406: R7.1 73.66,29.84 IC7.14
N$52
  Top 0.406: X2.1 68.58,48.26 C11.1
  Bottom 0.406: IC7.24 76.83,52.07 75.56,50.8 71.12,50.8 C11.1
N$53
  Top 0.406: C12.1 67.31,41.91 X2.2
  Bottom 0.406: IC7.23 79.38,49.53 75.56,45.72 73.03,45.72 69.85,42.55 C12.1
N$54
  Top 0.406: R5.1 R6.2 C9.2
QH*
  Top 0.406: JP6.8 71.12,26.04 69.85,27.3 68.58,27.3 67.31,26.04 67.31,24.77 66.67,24.13 62.87,24.13 59.05,27.94 IC4.9
RESET  (via drill 0.33)
  Top 0.406: 86.36,7.62 87,6.99 B0.3 86.36,7.62 | 86.36,7.62 85.09,8.89 | 85.09,8.89 ISP.5 | 86.36,7.62 80.64,7.62 B0.4 | R2.2 38.1,46.99 C5.1 55.88,48.26 59.05,48.26 67.94,39.37 IC7.10 | 85.09,8.89 88.9,12.7 84.45,17.14 77.47,17.14 72.39,22.23 72.39,26.04 v74.3,27.94
  Bottom 0.406: R2.2 35.56,52.07 IC5.1 | v74.3,27.94 75.56,27.94 76.2,28.57 76.2,37.47 IC7.10
RXD  (via drill 0.33)
  Top 0.406: v36.83,50.16 36.2,50.8 33.66,50.8 29.21,46.35 v24.13,46.35 | JP1.1 55.24,33.02 55.24,31.75 57.78,29.21 v57.78,26.67 | v24.13,18.41 21.59,15.88 21.59,14.61 20.32,13.34 15.24,13.34 13.34,15.24 13.34,21.59 12.7,22.23 12.7,28.57 9.53,31.75 6.99,31.75 3.81,34.92 3.81,40.64 v3.17,41.27
  Bottom 0.406: v36.83,50.16 IC5.2 | v24.13,46.35 24.13,47.62 14.61,57.15 9.53,57.15 JP2.4 6.99,54.61 6.99,45.09 v3.17,41.27 | v57.78,26.67 57.78,25.4 55.24,22.86 28.57,22.86 v24.13,18.41
SCK
  Top 0.406: IC7.8 72.39,46.35 72.39,50.8 64.14,59.05 59.05,59.05 IC5.19 55.24,62.87 28.57,62.87 15.88,50.16 12.7,50.16 IC6.SCK
  Bottom 0.406: 72.39,42.55 67.94,38.1 67.94,36.2 67.31,35.56 62.87,35.56 JP1.6 | IC7.8 72.39,42.55 | ISP.3 78.74,12.7 76.83,12.7 74.93,14.61 74.93,26.04 72.39,28.57 72.39,42.55
SCL  (via drill 0.33)
  Top 0.406: IC3.6 36.2,41.27 39.37,41.27 40.64,40.01 43.18,40.01 43.81,40.64 48.9,40.64 51.44,38.1 | 51.44,38.1 51.44,37.47 49.53,35.56 JP5.1 | v35.56,47.62 36.83,46.35 52.7,46.35 v53.34,45.72 | v57.15,45.09 57.78,45.09 59.05,43.81 59.05,43.18 | 59.05,43.18 59.05,42.55 57.78,41.27 54.61,41.27 51.44,38.1 | 59.05,43.18 v60.96,41.27
  Bottom 0.406: IC5.28 34.29,58.42 38.1,54.61 38.1,50.16 v35.56,47.62 | v53.34,45.72 56.52,45.72 v57.15,45.09 | JP1.8 64.14,38.1 v60.96,41.27
SDA  (via drill 0.33)
  Top 0.406: 41.91,39.37 v43.81,39.37 | 41.91,39.37 IC3.5 | v25.4,58.42 17.78,50.8 17.78,42.55 19.05,41.27 32.38,41.27 33.02,40.64 33.02,38.1 36.2,34.92 37.47,34.92 41.91,39.37 | JP1.7 62.87,33.02 v57.15,33.02
  Bottom 0.406: v43.81,39.37 46.99,36.2 JP5.2 46.99,34.92 48.9,33.02 v57.15,33.02 | IC5.27 34.92,62.87 29.84,62.87 v25.4,58.42
TXD  (via drill 0.33)
  Top 0.406: IC5.3 37.47,55.24 33.66,55.24 v33.02,55.88 | v51.44,31.75 JP1.2 | v43.81,31.75 v47.62,31.75 | v40.01,35.56 38.1,33.66 v33.02,33.66 | v19.05,33.66 v22.86,33.66 | v14.61,32.38 7.62,32.38 4.45,35.56 4.45,54.61 JP2.5
  Bottom 0.406: v33.02,55.88 17.14,55.88 13.97,59.05 JP2.5 | v47.62,31.75 v51.44,31.75 | v40.01,35.56 v43.81,31.75 | v22.86,33.66 v33.02,33.66 | v19.05,33.66 15.88,33.66 v14.61,32.38
VCC  (via drill 0.33)
  Top 0.406: R2.1 45.09,51.44 47.62,51.44 IC5.7 | v61.59,62.87 60.33,64.14 27.3,64.14 21.59,58.42 12.7,58.42 IC6.VDD | C4.1 12.06,19.05 C3.+ | IC3.8 18.41,39.37 16.51,37.47 16.51,31.75 19.05,29.21 19.05,22.86 | 55.88,27.3 56.52,27.94 IC4.10 55.88,27.3 | 55.88,27.3 53.98,25.4 43.81,25.4 41.27,27.94 IC4.16 | JP6.1 60.33,22.86 55.88,27.3 | JP5.3 44.45,34.92 43.18,34.92 42.55,34.29 41.91,34.29 40.64,33.02 v40.64,32.38 38.1,29.84 27.94,29.84 22.86,24.77 22.86,24.13 20.32,21.59 19.05,22.86 | IC7.28 80.01,60.33 80.01,56.52 IC7.25 83.82,56.52 95.89,56.52 97.16,55.24 B1.1 | IC7.19 IC7.20 | IC7.15 84.45,29.21 RN1.1 | L2.2 JP8.3 | IC2.3 19.05,22.86
  Bottom 0.406: 52.7,62.87 IC5.20 | 52.7,62.87 48.9,62.87 48.26,62.23 48.26,54.61 IC5.7 | 52.7,62.87 v61.59,62.87 62.87,62.87 63.5,63.5 67.31,63.5 70.48,60.33 72.39,60.33 73.03,60.96 79.38,60.96 80.64,62.23 IC7.28 | C3.+ 14.61,19.05 18.41,22.86 IC2.3 | v40.64,32.38 40.64,27.94 IC4.16 | IC7.19 85.72,39.37 89.53,35.56 RN1.1 | JP1.9 66.67,32.38 L2.2 72.39,24.13 64.77,24.13 JP6.1 | IC7.15 81.92,26.67 77.47,22.23 JP8.3 | IC7.25 83.19,54.61 86.36,51.44 86.36,48.9 83.19,45.72 80.64,45.72 80.01,45.09 80.01,43.81 IC7.20
VIN  (via drill 0.33)
  Top 0.406: v69.85,26.04 69.85,21.59 ISP.2 v71.12,7.62 | IC1.1 24.77,20.32 19.68,15.24 | 17.14,23.5 17.14,29.21 C2.+ | 17.14,23.5 IC2.2 | LED.A 8.89,42.55 9.53,43.18 9.53,46.35 6.99,48.9 6.99,52.07 JP2.3 | 19.68,15.24 17.78,15.24 v17.14,14.61 | v17.14,20.32 17.14,23.5 | 19.68,15.24 L1.2
  Bottom 0.406: JP3.3 50.16,43.18 50.16,41.27 55.88,35.56 57.78,35.56 JP1.3 60.33,33.02 62.87,33.02 v69.85,26.04 | LED.A 10.79,38.73 10.79,34.29 14.61,30.48 15.88,30.48 17.14,29.21 C2.+ | v17.14,14.61 v17.14,20.32 | v71.12,7.62 27.3,7.62 19.68,15.24 L1.2

### Text on the board
tNames: Sprinkler Controller (v1.1) | 41878 | Rayshobby, Jan 2012 | INT | RFM12B | FTDI | ATMEGA328 | ENC28J60 | BLK | 16x2 LCD | 1N4148 | TXD MOSI SCK SCL GND | 1N4001 | RTC Breakout | 24LC128 | SCL SDA VCC GND | RXD VIN MISO SDA VCC | 100u | DATA CLK LATCH QH* | LM2574 | 74HC595 | VCC | D3 | VCC GND 24VIN 24VAC | 1N5817 | GND | D9 | RJ45 | 24VAC
BoxDim: Serpac WM-032RC Enclosure | All units are in inch | Left | Right | Front | 0.14 | 0.32 | 1.28 | 0.91 | 0.32 | 1.0 | 0.26 | 0.4 | 0.29 | 3.25 | 0.45 | 0.7 | 0.53 | 0.4 | 0.32 | 0.63 | Bottom | 1.28 | 0.32 | 1.6 | 1.6 | 4.38